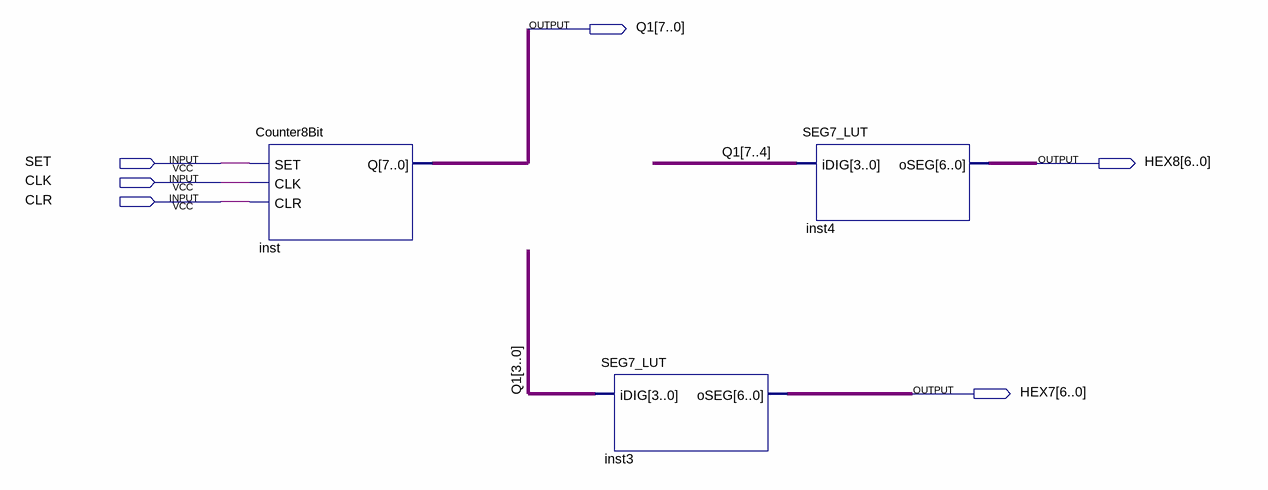
[diagram p0: schematic sheet]
// Quartus schematic 8BitCounter.bdf as structural Verilog: 3 symbols, 6 pins
module \8BitCounter  (
  input  SET,
  input  CLK,
  input  CLR,
  output [7:0] Q1,
  output [6:0] HEX8,
  output [6:0] HEX7
);

  Counter8Bit inst (.SET(SET), .CLK(CLK), .CLR(CLR), .Q(Q1));
  SEG7_LUT inst3 (.iDIG(Q1[3:0]), .oSEG(HEX7));
  SEG7_LUT inst4 (.iDIG(Q1[7:4]), .oSEG(HEX8));
endmodule
